# EAGLE design Venus_GPS-v14sma (EAGLE 5.04)
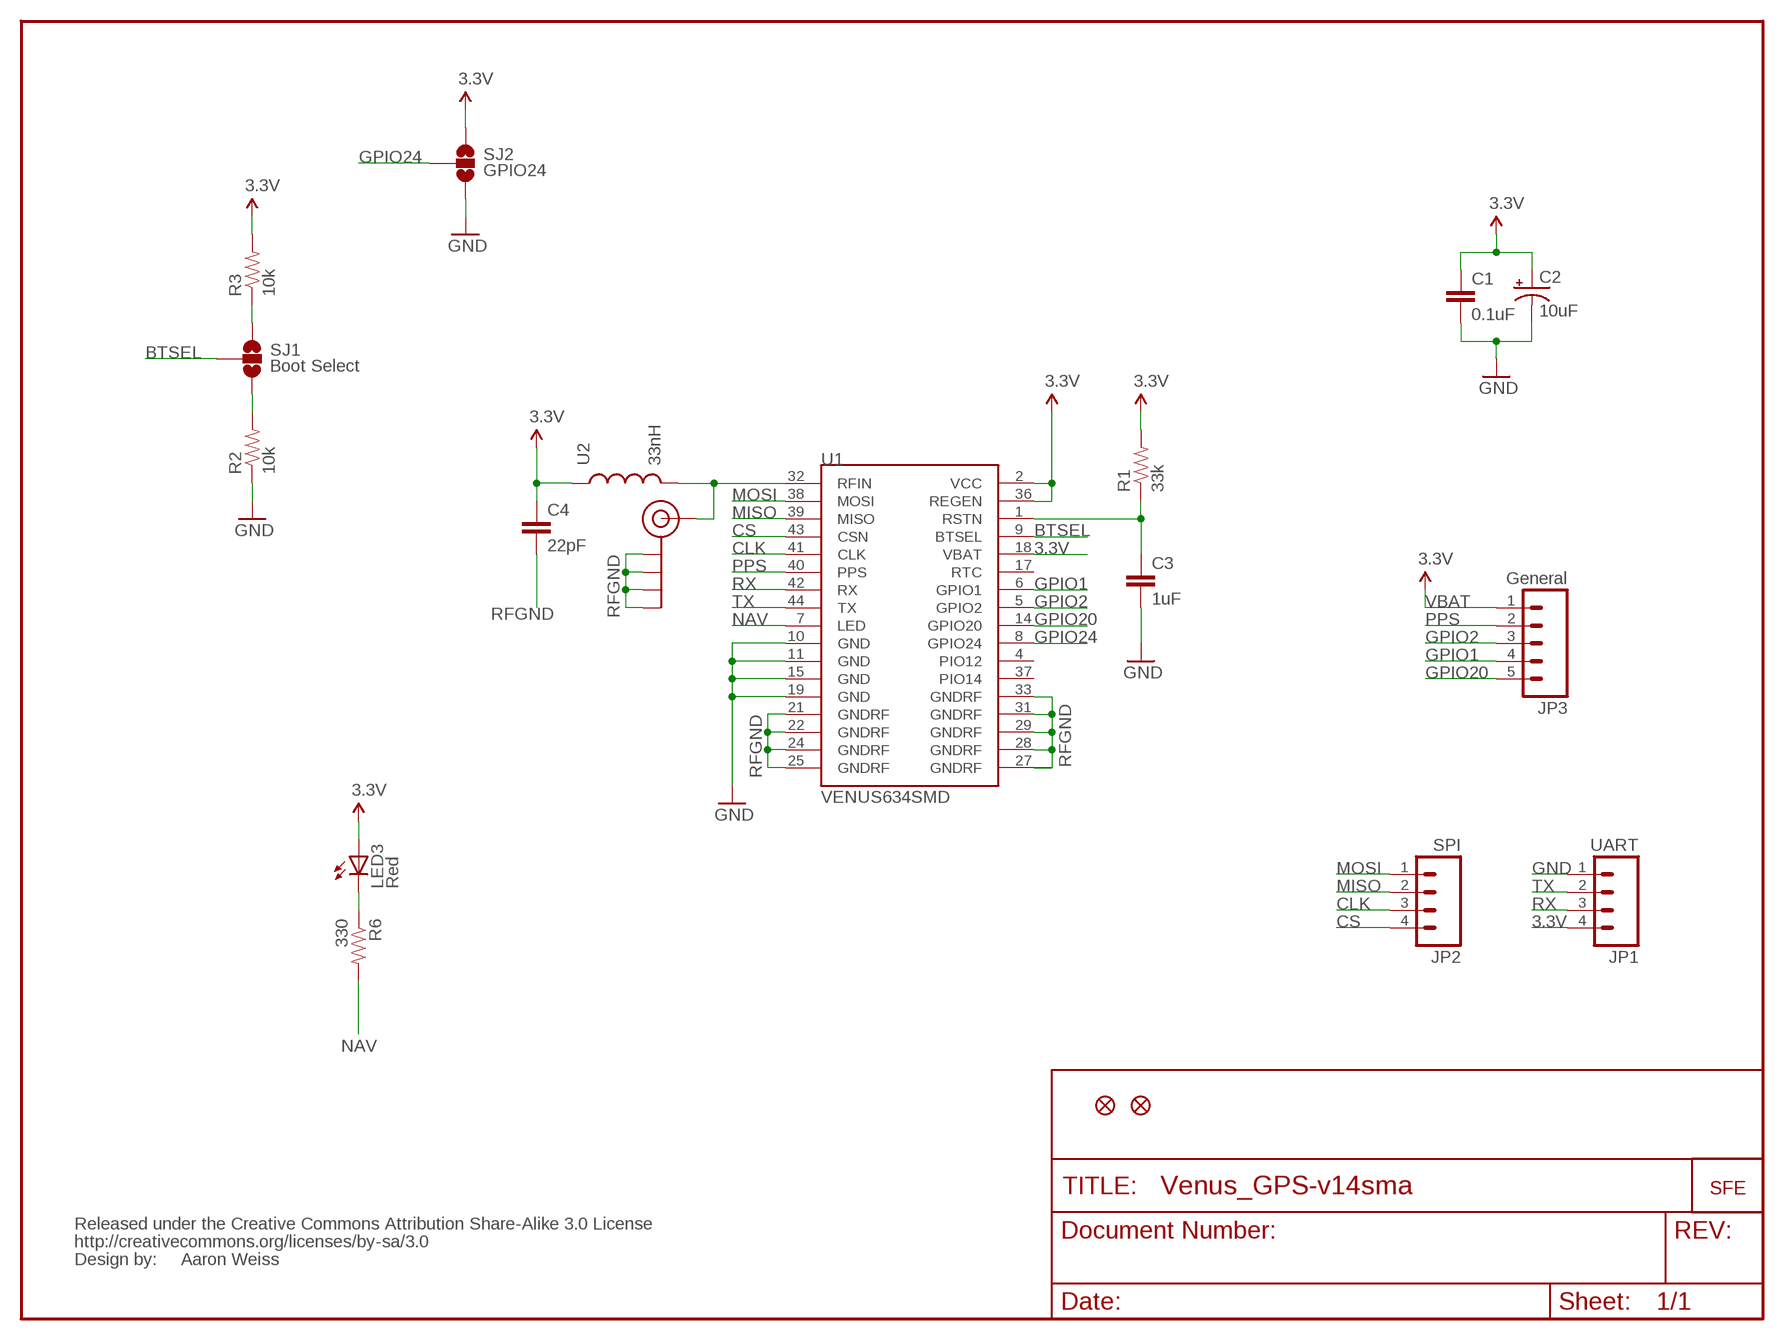
[diagram p0: schematic, sheet 1]

## Parts
C1  0.1uF  CAP0402  [C0402]
C2  10uF  CAP_POL1206  [EIA3216]
C3  1uF  CAP0402  [C0402]
C4  22pF  CAP0402  [C0402]
J$1  SMA_EDGE  [SMA-EDGE]
JP1  UART  M04PTH  [1X04]
JP2  SPI  M04PTH  [1X04]
JP3  General  M05PTH  [1X05]
LED3  Red  LED0603  [LED-0603]
R1  33k  RESISTOR0402  [C0402]
R2  10k  RESISTOR0402  [C0402]
R3  10k  RESISTOR0402  [C0402]
R6  330  RESISTOR0402  [C0402]
SJ1  Boot Select  SOLDERJUMPER_2WAYPASTE2&3  [SJ_3_PASTE2&3]
SJ2  GPIO24  SOLDERJUMPER_2WAYPASTE2&3  [SJ_3_PASTE2&3]
U1  VENUS634SMD  [LGA44]
U2  33nH  INDUCTOR0402  [C0402]
U$1  LOGO-SFESK  [SFE-LOGO-FLAME]
U$2  FIDUCIAL1X2  [FIDUCIAL-1X2]
U$3  FIDUCIAL1X2  [FIDUCIAL-1X2]
U$4  CREATIVE_COMMONS  [CREATIVE_COMMONS]

## Nets
3.3V: C1.1 C2.A(+) C4.1 JP1.4 JP3.1 LED3.A R1.2 R3.2 SJ2.1 U1.2(VCC) U1.18(VBAT) U1.36(REGEN) U2.1
BTSEL: SJ1.2 U1.9(BTSEL)
CLK: JP2.3 U1.41(CLK)
CS: JP2.4 U1.43(CSN)
GND: C1.2 C2.C(-) C3.2 JP1.1 R2.1 SJ2.3 U1.10(GND) U1.11(GND) U1.15(GND) U1.19(GND)
GPIO1: JP3.4 U1.6(GPIO1)
GPIO2: JP3.3 U1.5(GPIO2)
GPIO20: JP3.5 U1.14(GPIO20)
GPIO24: SJ2.2 U1.8(GPIO24)
MISO: JP2.2 U1.39(MISO)
MOSI: JP2.1 U1.38(MOSI)
N$1: LED3.C R6.1
N$3: C3.1 R1.1 U1.1(RSTN)
N$4: R3.1 SJ1.1
N$14: J$1.SIG(SIGNAL) U1.32(RFIN) U2.2
N$16: R2.2 SJ1.3
NAV: R6.2 U1.7(LED)
PPS: JP3.2 U1.40(PPS)
RFGND: C4.2 J$1.GND@0(GND) J$1.GND@1(GND) J$1.GND@2(GND) J$1.GND@3(GND) U1.21(GNDRF) U1.22(GNDRF) U1.24(GNDRF) U1.25(GNDRF) U1.27(GNDRF) U1.28(GNDRF) U1.29(GNDRF) U1.31(GNDRF) U1.33(GNDRF)
RX: JP1.3 U1.42(RX)
TX: JP1.2 U1.44(TX)
Unconnected: U1.4(PIO12) U1.17(RTC) U1.37(PIO14)

## Notes on the sheet
- VBAT
- Aaron Weiss

## Library data of the parts
C1 C3 C4 = SparkFun:CAP: Capacitor Standard 0603 ceramic capacitor, and 0.1" leaded capacitor.
C2 = SparkFun:CAP_POL: Capacitor Polarized These are standard SMD and PTH capacitors. Normally 10uF, 47uF, and 100uF in electrolytic and tantalum varieties. Always verify the external diameter of the through hole cap, it varies with capacity, voltage, and manufacturer. The EIA devices should be standard.
J$1 = SparkFun:SMA_EDGE: SMA Antenna Connector End launch SMA connector. The paste layer has been removed so that the connector can be hand soldered onto the board after reflow.
JP1 JP2 = SparkFun:M04: Header 4 Standard 4-pin 0.1" header. Use with straight break away headers (SKU : PRT-00116), right angle break away headers (PRT-00553), swiss pins (PRT-00743), machine pins (PRT-00117), and female headers (PRT-00115). Molex polarized connector foot print use with SKU : PRT-08231 with associated crimp pins and housings.
JP3 = SparkFun:M05: Header 5 Standard 5-pin 0.1" header. Use with straight break away headers (SKU : PRT-00116), right angle break away headers (PRT-00553), swiss pins (PRT-00743), machine pins (PRT-00117), and female headers (PRT-00115). Molex polarized connector foot print use with SKU : PRT-08230 with associated crimp pins and housings.
LED3 = SparkFun:LED: LEDs Standard schematic elements and footprints for 5mm, 3mm, 1206, and 0603 sized LEDs. 5mm - Spark Fun Electronics SKU : COM-00529 (and others)
R1-R3 R6 = SparkFun:RESISTOR: Resistor Basic schematic elements and footprints for 0603, 1206, and PTH 1/10th watt (small) resistors.
SJ1 SJ2 = SparkFun:SOLDERJUMPER_2WAY: Solder Jumper 2 way solder jumper
U1 = SparkFun:VENUS634: Venus634 from SkyTraq
U2 = SparkFun:INDUCTOR: Inductors Basic Inductor/Choke - 0603 and 1206. Footprints are not proven and vary greatly between part numbers.
U$1 = SparkFun:LOGO-SFE: Spark Fun Electronics PCB Logo This is the standard Spark Fun Electronics PCB logo.
U$2 U$3 = SparkFun:FIDUCIAL: Fiducial Alignment Points Various fiducial points for machine vision alignment.
U$4 = SparkFun:CREATIVE_COMMONS

## Board
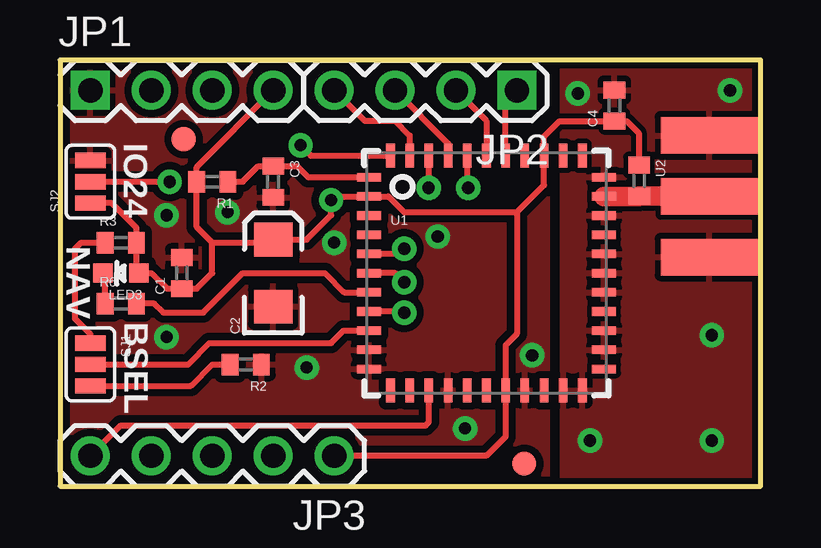
[diagram p1: board, top side]
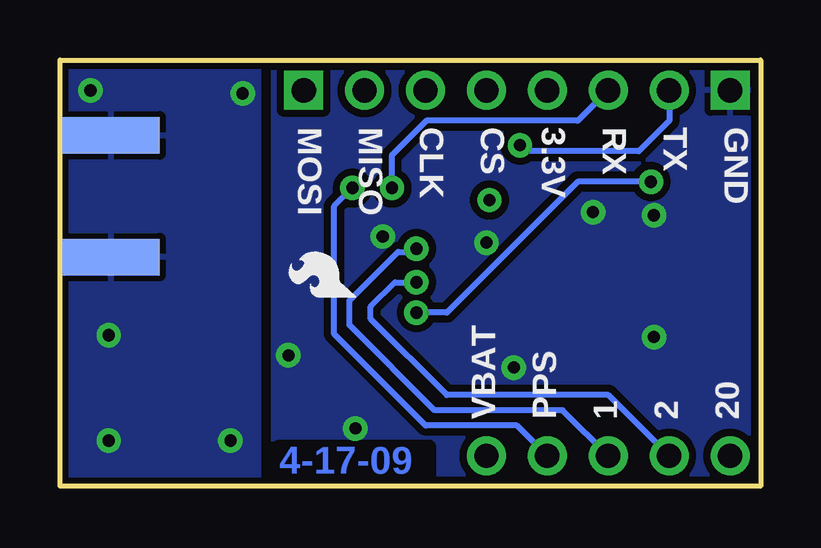
[diagram p2: board, bottom side, seen from below]

Size 29.21 x 17.78 mm. Coordinates in mm from the lower left corner, seen from the top.
Outline: 0,0 29.21,0 29.21,17.78 0,17.78 0,0
Copper layers (1*16): Top 0.035mm / dielectric 1.5mm / Bottom 0.035mm
Design rules "SparkFun": minimum track width 8mil, minimum drill 20mil, track to track 8mil, track to pad 8mil, pad to pad 8mil, via to via 8mil, smd to smd 8mil, copper to edge 10mil, drill to drill 8mil, minimum pad ring 12mil, minimum via ring 10mil, stop-mask expansion 4mil, vias tented up to drill 25mil, thermal gap 10mil

### Footprints (pad centres in the part's own frame; a part is rotated, then mirrored left to right if it is on the bottom)
C0402 = smd 0.7 x 0.9: 1 -0.65,0; 2 0.65,0
EIA3216 = smd 1.4 x 1.6: A 1.4,0; C -1.4,0
SMA-EDGE = smd 1.524 x 4.064: GND@0 0,0; GND@1 5.08,0; SIG 2.54,0 | smd 1.524 x 4.064 bottom: GND@2 0,0; GND@3 5.08,0
1X04 = drill 1.016 square: 1 0,0 | drill 1.016 round: 2 2.54,0; 3 5.08,0; 4 7.62,0
1X05 = drill 1.016 round: 1 0,0; 2 2.54,0; 3 5.08,0; 4 7.62,0; 5 10.16,0
LED-0603 = smd 0.8 x 0.8: A 0,-0.75; C 0,0.75
SJ_3_PASTE2&3 = smd 0.635 x 1.27: 1 -0.889,0; 2 0,0; 3 0.889,0
LGA44 = smd 1 x 0.36: 1 -4.9,4; 2 -4.9,3.2; 3 -4.9,2.4; 4 -4.9,1.6; 5 -4.9,0.8; 6 -4.9,0; 7 -4.9,-0.8; 8 -4.9,-1.6; 9 -4.9,-2.4; 10 -4.9,-3.2; 11 -4.9,-4; 23 4.9,-4; 24 4.9,-3.2; 25 4.9,-2.4; 26 4.9,-1.6; 27 4.9,-0.8; 28 4.9,0; 29 4.9,0.8; 30 4.9,1.6; 31 4.9,2.4; 32 4.9,3.2; 33 4.9,4 | smd 0.36 x 1: 12 -4,-4.9; 13 -3.2,-4.9; 14 -2.4,-4.9; 15 -1.6,-4.9; 16 -0.8,-4.9; 17 0,-4.9; 18 0.8,-4.9; 19 1.6,-4.9; 20 2.4,-4.9; 21 3.2,-4.9; 22 4,-4.9; 34 4,4.9; 35 3.2,4.9; 36 2.4,4.9; 37 1.6,4.9; 38 0.8,4.9; 39 0,4.9; 40 -0.8,4.9; 41 -1.6,4.9; 42 -2.4,4.9; 43 -3.2,4.9; 44 -4,4.9
FIDUCIAL-1X2 = smd 1 x 1: 1 0,0

### Placement (x,y rotation side)
C1  5.08,8.89 90 top
C2  8.89,8.89 90 top
C3  8.89,12.7 270 top
C4  23.11,15.88 90 top
J$1  27.08,9.55 90 top
JP1  1.27,16.51 0 top
JP2  19.05,16.51 180 top
JP3  11.43,1.27 180 top
LED3  2.54,8.89 90 top
R1  6.35,12.7 180 top
R2  7.75,5.08 180 top
R3  2.54,10.16 0 top
R6  2.54,7.62 0 top
SJ1  1.27,5.08 270 top
SJ2  1.27,12.7 90 top
U1  17.78,8.89 0 top
U2  24.14,12.74 270 top
U$1  16.87,7.9 90 bottom
U$2  5.16,14.48 0 top
U$3  19.35,0.94 0 top
U$4  20.32,-11.43 0 top  (outside the outline)

### Tracks (layer width: path | path; a pad name or v marks a point on that pad's centre or on a via)
3.3V  (via drill 0.51)
  Top 0.254: U2.1 24.13,14.73 23.64,15.22 C4.1 20.81,15.22 20.18,14.59 U1.36 20.18,12.56 19.05,11.43 | 19.05,11.43 14.35,11.43 13.69,12.09 U1.2 11.71,12.09 v11.3,11.94 11.3,11.3 10.29,10.29 C2.A 8.76,10.16 6.35,10.16 | JP3.1 17.78,1.27 18.58,2.07 U1.18 18.58,5.88 19.05,6.35 19.05,11.43 | JP1.4 5.7,13.32 R1.2 5.7,10.81 6.35,10.16 | SJ2.1 2.16,11.81 3.19,10.78 R3.2 3.19,8.99 LED3.A 3.81,8.89 4.46,8.24 C1.1 5.7,8.24 6.35,8.89 6.35,10.16
BTSEL
  Top 0.254: SJ1.2 5.33,5.08 6.22,5.97 11.3,5.97 11.82,6.49 U1.9
CLK
  Top 0.254: U1.41 16.18,14.3 JP2.3
CS
  Top 0.254: U1.43 14.58,14.63 13.97,15.24 12.7,15.24 JP2.4
GND  (via drill 0.51)
  other vias: 4.45,6.22 15.75,10.41 19.68,5.46 6.99,11.43 16.89,2.41 11.43,10.16 4.45,11.3 10.29,4.95
  pour Bottom (isolate 0.305): 0,17.78 20.32,17.78 20.32,0 0,0
  pour Top (isolate 0.305): 0,17.78 20.32,17.78 20.32,0 0,0
GPIO1  (via drill 0.51)
  Top 0.254: U1.6 13.97,8.89 v14.35,8.51
  Bottom 0.254: JP3.4 6.35,3.81 13.08,3.81 16.26,6.99 16.26,7.49 15.24,8.51 v14.35,8.51
GPIO2  (via drill 0.51)
  Top 0.254: U1.5 14.13,9.69 v14.35,9.91
  Bottom 0.254: JP3.3 8.26,3.17 13.59,3.17 17.14,6.73 17.14,7.75 15.11,9.78 14.48,9.78 v14.35,9.91
GPIO20
  Top 0.254: JP3.5 2.54,2.54 15.24,2.54 15.38,2.68 U1.14
GPIO24  (via drill 0.51)
  Top 0.254: SJ2.2 v4.57,12.7 | U1.8 14.3,7.29 v14.35,7.24
  Bottom 0.254: v4.57,12.7 7.62,12.7 13.08,7.24 v14.35,7.24
MISO
  Top 0.254: U1.39 17.78,15.24 JP2.2
MOSI
  Top 0.254: U1.38 18.58,16.04 JP2.1
N$1
  Top 0.254: R6.1 1.89,8.79 LED3.C
N$3
  Top 0.254: U1.1 10.35,12.89 9.89,13.35 C3.1 8.27,13.35 7.62,12.7 R1.1
N$4
  Top 0.254: R3.1 0.89,10.16 0.64,9.91 0.64,6.99 1.27,6.35 SJ1.1
N$14
  Top 0.813: J$1.SIG U2.2 U1.32
N$16
  Top 0.254: SJ1.3 5.46,4.19 6.35,5.08 R2.2
NAV
  Top 0.254: R6.2 3.94,7.62 4.32,7.24 5.97,7.24 7.62,8.89 11.05,8.89 11.85,8.09 U1.7
PPS  (via drill 0.51)
  Top 0.254: U1.40 16.98,12.48 v17.02,12.45
  Bottom 0.254: JP3.2 10.16,2.54 13.97,2.54 17.78,6.35 17.78,11.68 v17.02,12.45
RFGND  (via drill 0.51)
  other vias: 21.59,16.38 22.1,1.91 27.18,1.91 27.94,16.51 27.18,6.3
  pour Top: 20.95,17.78 20.95,0 29.21,0 29.21,17.65 29.21,17.78
  pour Bottom: 20.95,17.78 20.95,0 29.21,0 29.21,17.78
RX  (via drill 0.51)
  Top 0.254: U1.42 v15.38,12.46 v15.37,12.45
  Bottom 0.254: JP1.3 7.62,15.24 13.93,15.24 U1.42 v15.38,12.46 v15.37,12.45
TX  (via drill 0.51)
  Top 0.254: U1.44 10.47,13.79 v10.03,14.22
  Bottom 0.254: JP1.2 3.81,15.24 5.08,13.97 9.78,13.97 v10.03,14.22

### Text on the board
Bottom: 4-17-09
tPlace: IO24 | NAV | BSEL
bPlace: GND | TX | RX | 3.3V | CS | CLK | MISO | MOSI | 20 | 2 | 1 | PPS | VBAT